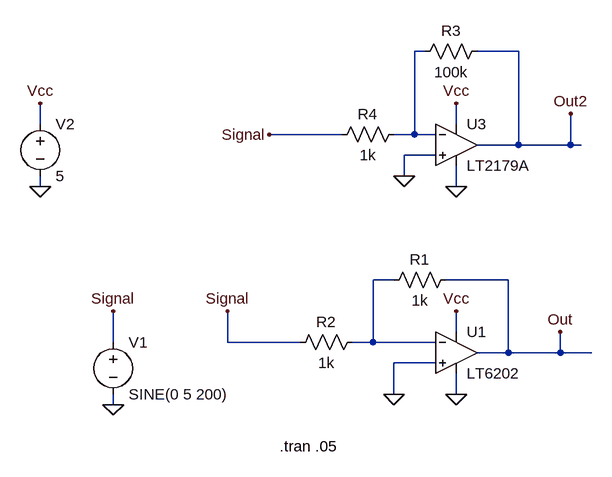
[diagram p0: schematic testRtR1.asc]
testRtR1.asc, the LTspice schematic file:
Version 4
SHEET 1 880 680
WIRE 128 -320 112 -320
WIRE 272 -320 208 -320
WIRE -464 -208 -464 -240
WIRE 176 -208 176 -240
WIRE 0 -192 -112 -192
WIRE 112 -192 112 -320
WIRE 112 -192 80 -192
WIRE 144 -192 112 -192
WIRE 272 -176 272 -320
WIRE 272 -176 208 -176
WIRE 352 -176 352 -224
WIRE 352 -176 272 -176
WIRE 368 -176 352 -176
WIRE 144 -160 96 -160
WIRE 96 -128 96 -160
WIRE -464 -112 -464 -128
WIRE 176 -112 176 -144
WIRE 80 32 48 32
WIRE 256 32 160 32
WIRE 176 112 176 80
WIRE -352 128 -352 80
WIRE -176 128 -176 80
WIRE -64 128 -176 128
WIRE 48 128 48 32
WIRE 48 128 16 128
WIRE 144 128 48 128
WIRE 256 144 256 32
WIRE 256 144 208 144
WIRE 336 144 336 112
WIRE 336 144 256 144
WIRE 384 144 336 144
WIRE 144 160 80 160
WIRE 80 208 80 160
WIRE 176 208 176 176
WIRE -352 224 -352 208
FLAG -464 -112 0
FLAG -352 224 0
FLAG 80 208 0
FLAG 176 208 0
FLAG -464 -240 Vcc
FLAG 176 80 Vcc
FLAG 336 112 Out
FLAG 176 -240 Vcc
FLAG 176 -112 0
FLAG 96 -128 0
FLAG -352 80 Signal
FLAG -176 80 Signal
FLAG -112 -192 Signal
FLAG 352 -224 Out2
SYMBOL OpAmps\\LT6202 176 144 R0
SYMATTR InstName U1
SYMBOL voltage -352 112 R0
WINDOW 123 0 0 Left 0
WINDOW 39 0 0 Left 0
SYMATTR InstName V1
SYMATTR Value SINE(0 5 200)
SYMBOL voltage -464 -224 R0
WINDOW 123 0 0 Left 0
WINDOW 39 0 0 Left 0
SYMATTR InstName V2
SYMATTR Value 5
SYMBOL res 176 16 R90
WINDOW 0 0 56 VBottom 2
WINDOW 3 32 56 VTop 2
SYMATTR InstName R1
SYMATTR Value 1k
SYMBOL res 32 112 R90
WINDOW 0 0 56 VBottom 2
WINDOW 3 32 56 VTop 2
SYMATTR InstName R2
SYMATTR Value 1k
SYMBOL res 224 -336 R90
WINDOW 0 0 56 VBottom 2
WINDOW 3 32 56 VTop 2
SYMATTR InstName R3
SYMATTR Value 100k
SYMBOL res 96 -208 R90
WINDOW 0 0 56 VBottom 2
WINDOW 3 32 56 VTop 2
SYMATTR InstName R4
SYMATTR Value 1k
SYMBOL OpAmps\\LT2179A 176 -240 R0
SYMATTR InstName U3
TEXT -96 288 Left 2 !.tran .05

The netlist it stands for:
* testRtR1.asc
* U1: LT6202 (symbol OpAmps\LT6202 not available, pins judged from their places): In+=0 In-=N002 V+=Vcc V-=0 OUT=Out
V1 Signal 0 SINE(0 5 200)
V2 Vcc 0 5
R1 Out N002 1k
R2 N002 Signal 1k
R3 Out2 N001 100k
R4 N001 Signal 1k
XU3 0 N001 Vcc 0 Out2 LT2179A  ; pins In+ In- V+ V- OUT
.tran .05
.backanno
.end